# EasyEDA schematic SCH_semi-automatic-healing-reminder_2026-02-17.json
TITLE: Sheet_1; REV: 1.0; Date: 2026-02-15; Sheet: 1/1; Drawn By: siudin22; Company: Your Company
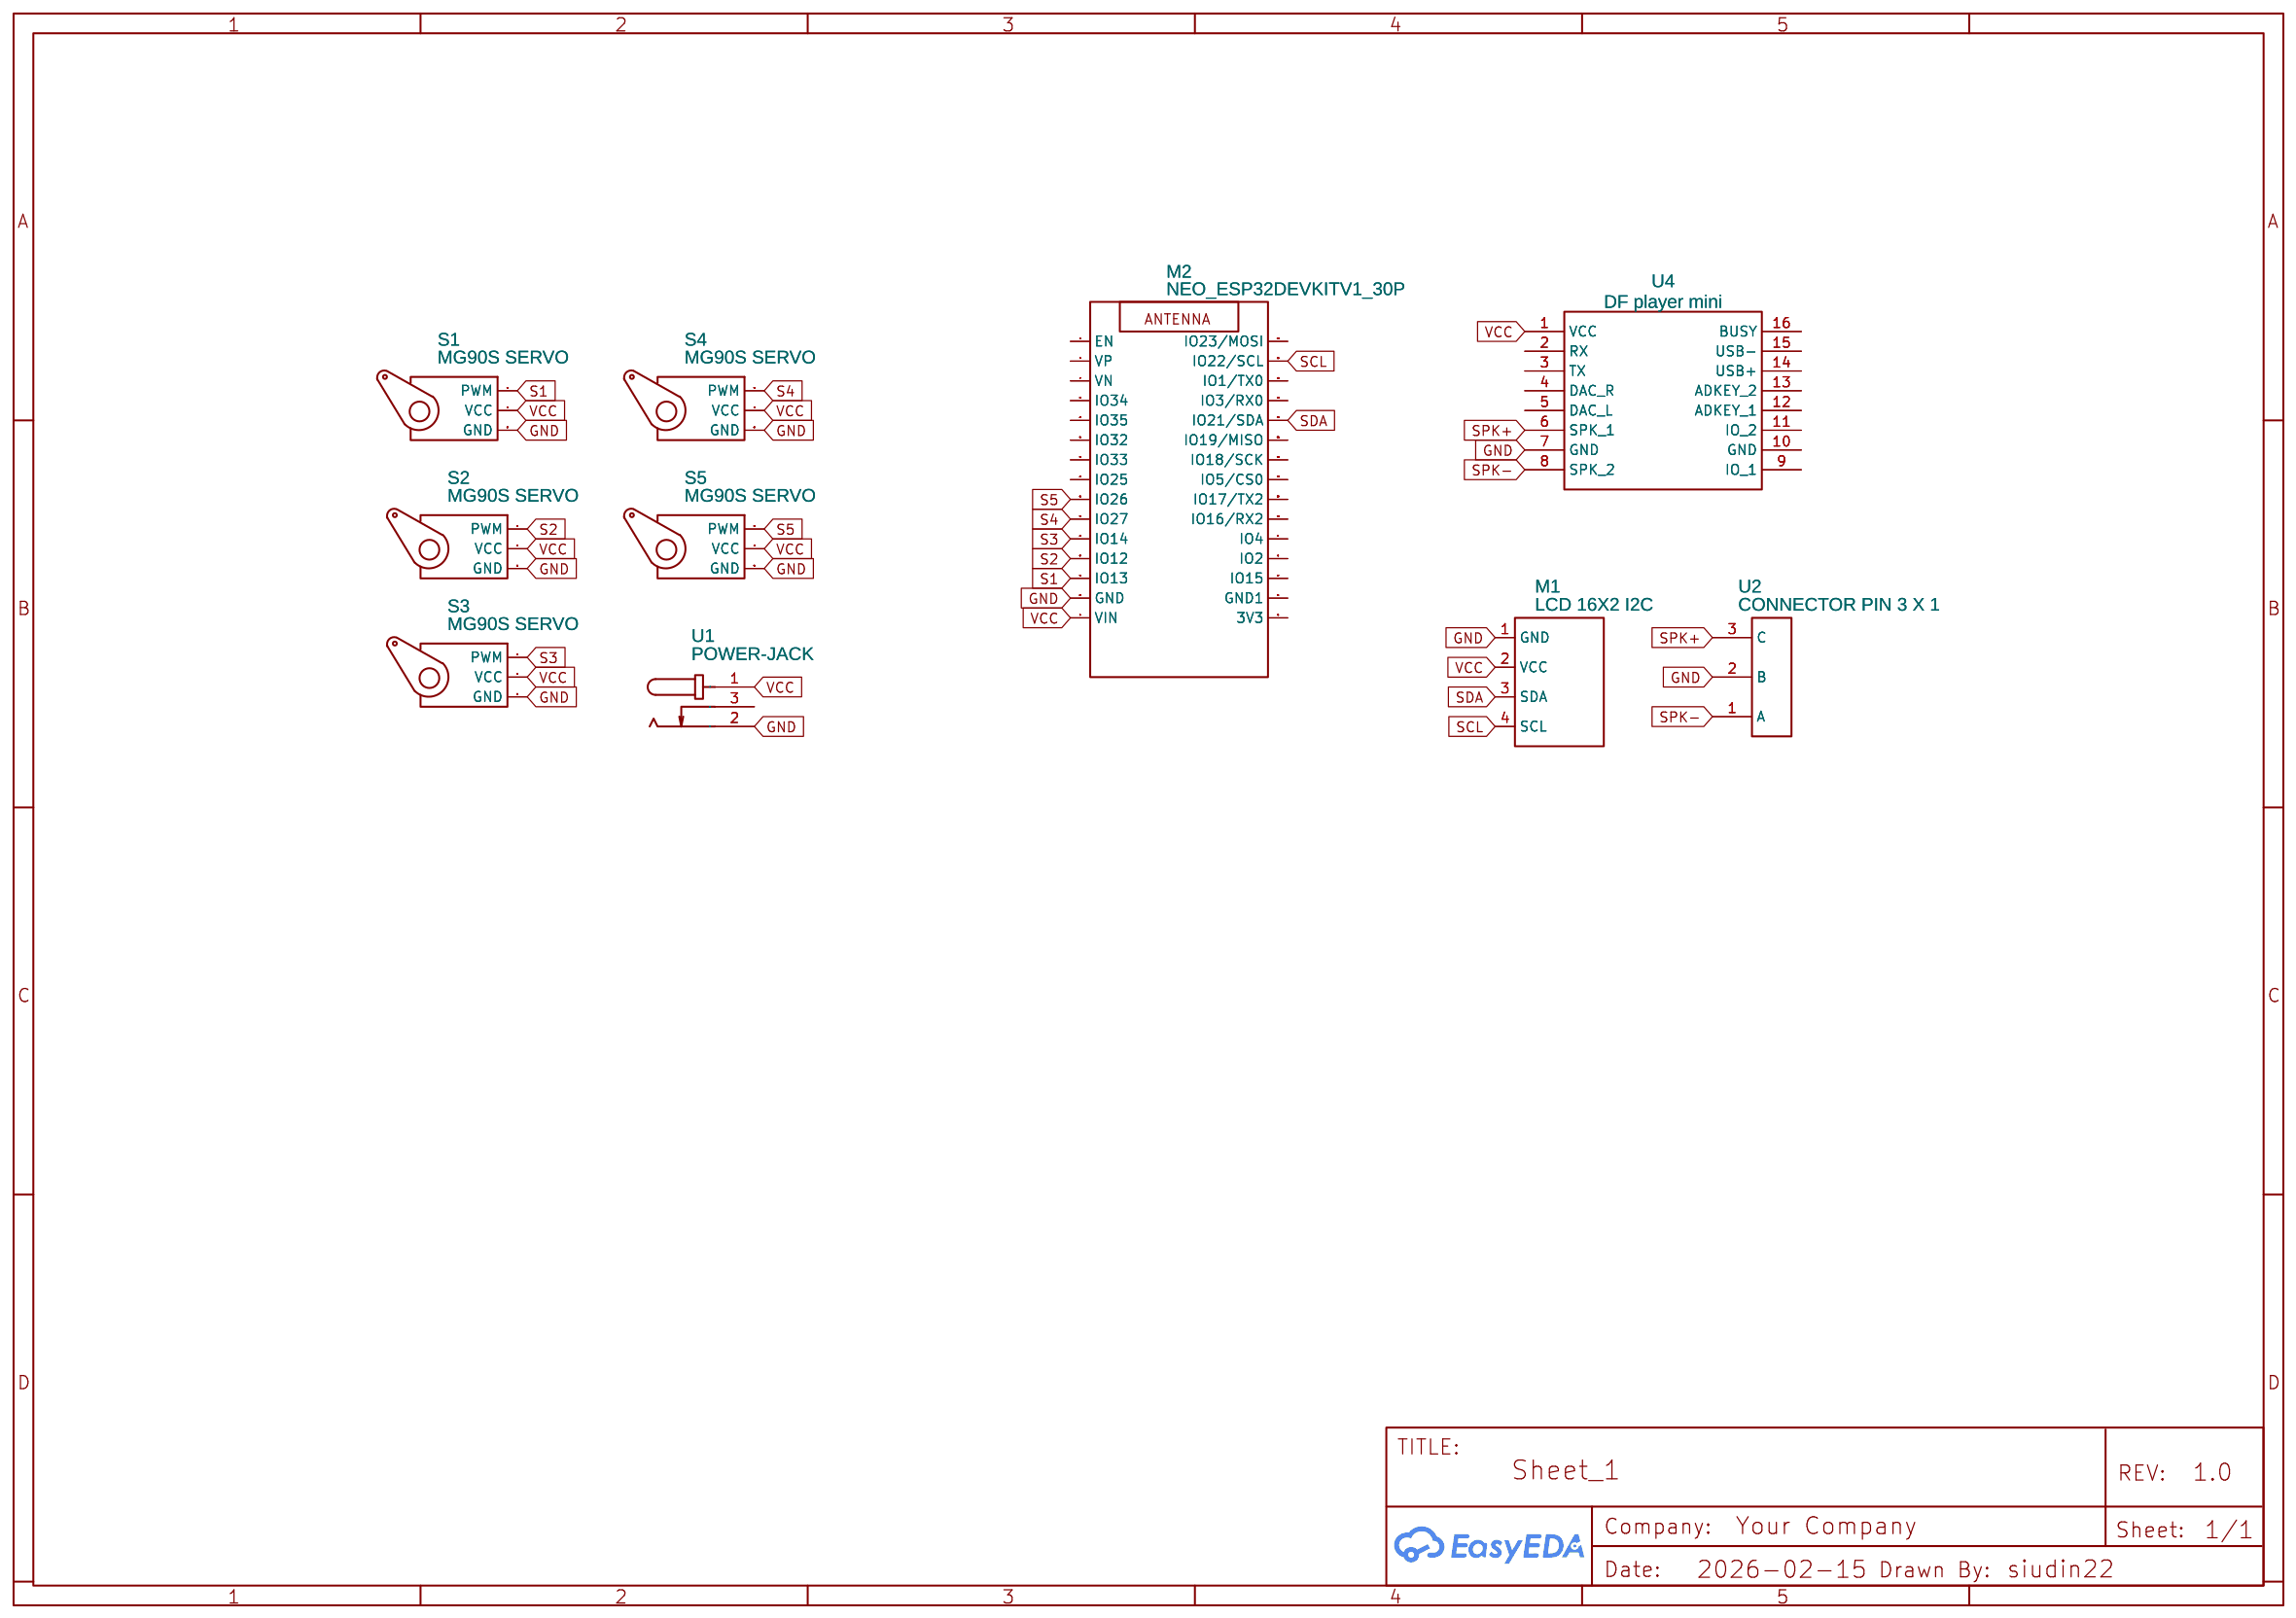
[diagram p0: schematic sheet]

## Parts
M1  LCD 16X2 I2C  [LCD-TH_LCD-1602-2X16-BLUE-WHITE]
M2  NEO_ESP32DEVKITV1_30P  [ESP32DEVKITV1_30P_FP]
S1  MG90S SERVO  [MG90S SERVO ADAL]
S2  MG90S SERVO  [MG90S SERVO ADAL]
S3  MG90S SERVO  [MG90S SERVO ADAL]
S4  MG90S SERVO  [MG90S SERVO ADAL]
S5  MG90S SERVO  [MG90S SERVO ADAL]
U1  POWER-JACK  [DC-IN-TH_POWER-JACK]
U2  CONNECTOR PIN 3 X 1  [CONNECTOR-PIN-3X1]
U4  DF player mini  [DFPLAYER MINI MP3 PLAYER MODULE]

## Library data of the parts
M1 = LCD 16X2 I2C: Contributor: edixtron.solutions
M2 = NEO_ESP32DEVKITV1_30P: Contributor: Ajik
S1-S5 = MG90S SERVO: Contributor: aakashagrawal1805
U1 = POWER-JACK: Contributor: LCSC; Supplier: LCSC; Supplier Part: C9900001795; Manufacturer: 索峰; JLCPCB Part Class: Extended Part
U2 = CONNECTOR PIN 3 X 1: Contributor: leandrobnsilva
U4 = DF player mini: Contributor: Circuit Master; sourceId: cKDVP7pjB

## Nets
GND: M1.1(GND) M2.GND S1.GND S2.GND S3.GND S4.GND S5.GND U1.2 U2.2(B) U4.7(GND)
VCC: M1.2(VCC) M2.VIN S1.VCC S2.VCC S3.VCC S4.VCC S5.VCC U1.1 U4.1(VCC)
S1: M2.IO13 S1.PWM
S2: M2.IO12 S2.PWM
S3: M2.IO14 S3.PWM
S4: M2.IO27 S4.PWM
S5: M2.IO26 S5.PWM
SCL: M1.4(SCL) M2.IO22/SCL
SDA: M1.3(SDA) M2.IO21/SDA
SPK+: U2.3(C) U4.6(SPK_1)
SPK-: U2.1(A) U4.8(SPK_2)

Not connected (* = marked no-connect by the designer): M2 3V3 EN GND1 IO1/TX0 IO2 IO3/RX0 IO4 IO5/CS0 IO15 IO16/RX2 IO17/TX2 IO18/SCK IO19/MISO IO23/MOSI IO25 IO32 IO33 IO34 IO35 VN VP; U1 3; U4 2(RX) 3(TX) 4(DAC_R) 5(DAC_L) 9(IO_1) 10(GND) 11(IO_2) 12(ADKEY_1) 13(ADKEY_2) 14(USB+) 15(USB-) 16(BUSY)
